# EAGLE design tiva-c (EAGLE 8.6.1)
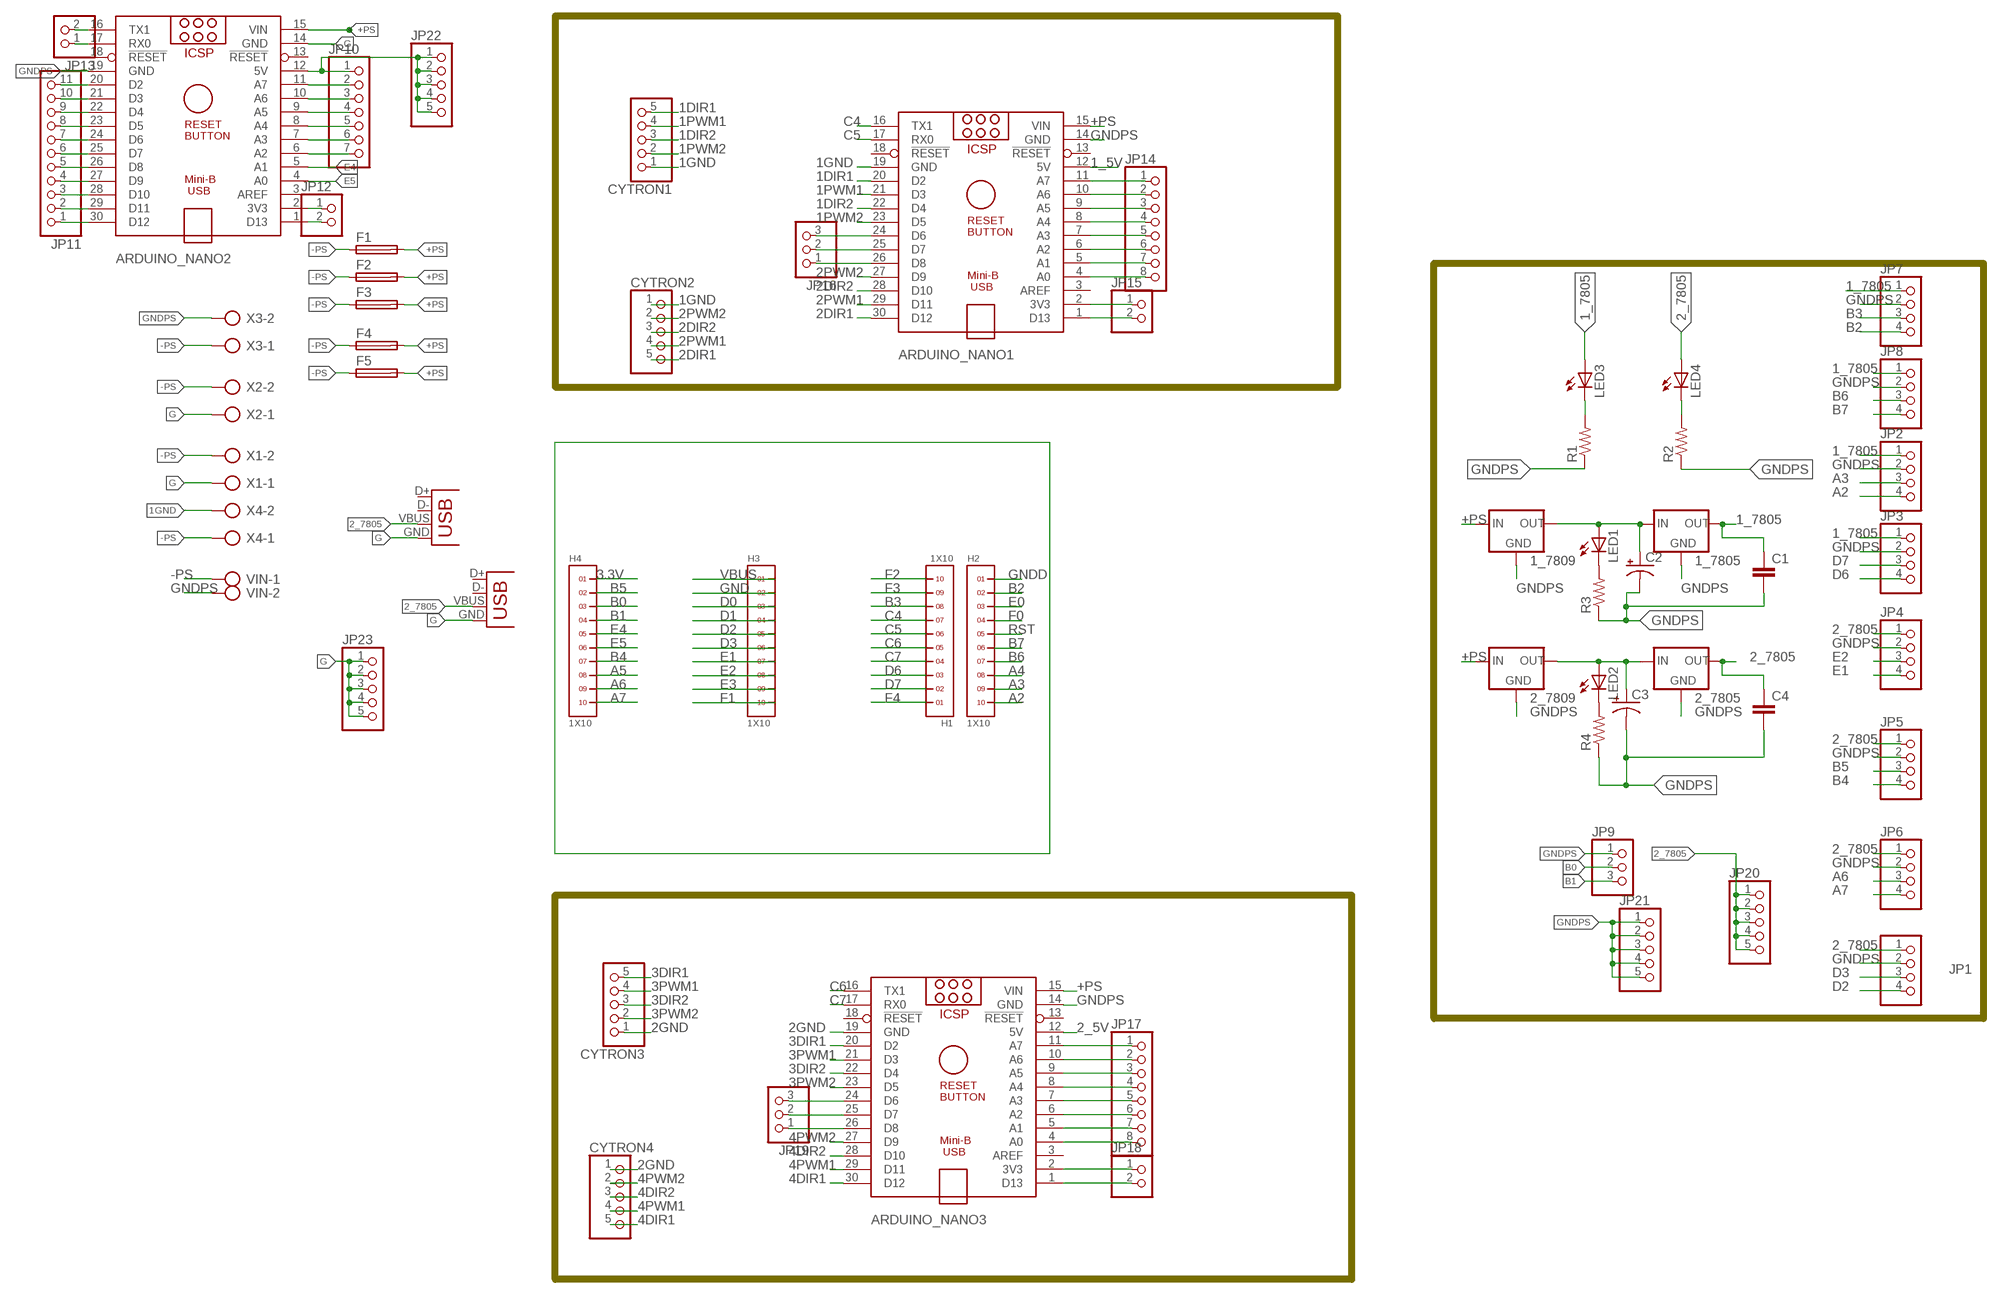
[diagram p0: schematic, sheet 1]

## Parts
1_7805  78XXS  [78XXS]
1_7809  78XXS  [78XXS]
2_7805  78XXS  [78XXS]
2_7809  78XXS  [78XXS]
ARDUINO_NANO1  ARDUINO_NANO  [ARDUINO_NANO]
ARDUINO_NANO2  ARDUINO_NANO  [ARDUINO_NANO]
ARDUINO_NANO3  ARDUINO_NANO  [ARDUINO_NANO]
C1  C-EU025-030X050  [C025-030X050]
C2  CPOL-USE2.5-5  [E2,5-5]
C3  CPOL-USE2.5-5  [E2,5-5]
C4  C-EU025-030X050  [C025-030X050]
CYTRON1  PINHD-1X5  [1X05]
CYTRON2  PINHD-1X5  [1X05]
CYTRON3  PINHD-1X5  [1X05]
CYTRON4  PINHD-1X5  [1X05]
F1  SH22,5A  [SH22,5A]
F2  SH22,5A  [SH22,5A]
F3  SH22,5A  [SH22,5A]
F4  SH22,5A  [SH22,5A]
F5  SH22,5A  [SH22,5A]
H1  1X10  [1X10]
H2  1X10  [1X10]
H3  1X10  [1X10]
H4  1X10  [1X10]
JP1  PINHD-1X4  [1X04]
JP2  PINHD-1X4  [1X04]
JP3  PINHD-1X4  [1X04]
JP4  PINHD-1X4  [1X04]
JP5  PINHD-1X4  [1X04]
JP6  PINHD-1X4  [1X04]
JP7  PINHD-1X4  [1X04]
JP8  PINHD-1X4  [1X04]
JP9  PINHD-1X3  [1X03]
JP10  PINHD-1X7  [1X07]
JP11  PINHD-1X11  [1X11]
JP12  PINHD-1X2  [1X02]
JP13  PINHD-1X2  [1X02]
JP14  PINHD-1X8  [1X08]
JP15  PINHD-1X2  [1X02]
JP16  PINHD-1X3  [1X03]
JP17  PINHD-1X8  [1X08]
JP18  PINHD-1X2  [1X02]
JP19  PINHD-1X3  [1X03]
JP20  PINHD-1X5  [1X05]
JP21  PINHD-1X5  [1X05]
JP22  PINHD-1X5  [1X05]
JP23  PINHD-1X5  [1X05]
LED1  LED5MM  [LED5MM]
LED2  LED5MM  [LED5MM]
LED3  LED5MM  [LED5MM]
LED4  LED5MM  [LED5MM]
R1  R-US_0204/5  [0204/5]
R2  R-US_0204/5  [0204/5]
R3  R-US_0204/5  [0204/5]
R4  R-US_0204/5  [0204/5]
VIN  AK300/2  [AK300/2]
X1  AK300/2  [AK300/2]
X2  AK300/2  [AK300/2]
X3  AK300/2  [AK300/2]
X4  AK300/2  [AK300/2]
X5  USB-A-H  [USB-A-H]
X6  USB-A-H  [USB-A-H]

## Nets
1_5V: ARDUINO_NANO1.12(5V)
1_7805: 1_7805.OUT C1.1 JP2.1 JP3.1 JP7.1 JP8.1 LED3.A
1DIR1: ARDUINO_NANO1.20(D2) CYTRON1.5
1DIR2: ARDUINO_NANO1.22(D4) CYTRON1.3
1GND: ARDUINO_NANO1.19(GND) CYTRON1.1 CYTRON2.1 X4.2
1PWM1: ARDUINO_NANO1.21(D3) CYTRON1.4
1PWM2: ARDUINO_NANO1.23(D5) CYTRON1.2
2_5V: ARDUINO_NANO3.12(5V)
2_7805: 2_7805.OUT C4.1 JP1.1 JP4.1 JP5.1 JP6.1 JP20.1 JP20.2 JP20.3 JP20.4 JP20.5 LED4.A X5.VBUS X6.VBUS
2DIR1: ARDUINO_NANO1.30(D12) CYTRON2.5
2DIR2: ARDUINO_NANO1.28(D10) CYTRON2.3
2GND: ARDUINO_NANO3.19(GND) CYTRON3.1 CYTRON4.1
2PWM1: ARDUINO_NANO1.29(D11) CYTRON2.4
2PWM2: ARDUINO_NANO1.27(D9) CYTRON2.2
3.3V: H4.1
3DIR1: ARDUINO_NANO3.20(D2) CYTRON3.5
3DIR2: ARDUINO_NANO3.22(D4) CYTRON3.3
3PWM1: ARDUINO_NANO3.21(D3) CYTRON3.4
3PWM2: ARDUINO_NANO3.23(D5) CYTRON3.2
4DIR1: ARDUINO_NANO3.30(D12) CYTRON4.5
4DIR2: ARDUINO_NANO3.28(D10) CYTRON4.3
4PWM1: ARDUINO_NANO3.29(D11) CYTRON4.4
4PWM2: ARDUINO_NANO3.27(D9) CYTRON4.2
+PS: 1_7809.IN 2_7809.IN ARDUINO_NANO1.15(VIN) ARDUINO_NANO2.15(VIN) ARDUINO_NANO3.15(VIN) F1.2 F2.2 F3.2 F4.2 F5.2
-PS: F1.1 F2.1 F3.1 F4.1 F5.1 VIN.1 X1.2 X2.2 X3.1 X4.1
A2: H2.10 JP2.4
A3: H2.9 JP2.3
A4: H2.8
A5: H4.8
A6: H4.9 JP6.3
A7: H4.10 JP6.4
B0: H4.3 JP9.2
B1: H4.4 JP9.3
B2: H2.2 JP7.4
B3: H1.8 JP7.3
B4: H4.7 JP5.4
B5: H4.2 JP5.3
B6: H2.7 JP8.3
B7: H2.6 JP8.4
C4: ARDUINO_NANO1.16(TX1) H1.7
C5: ARDUINO_NANO1.17(RX0) H1.6
C6: ARDUINO_NANO3.16(TX1) H1.5
C7: ARDUINO_NANO3.17(RX0) H1.4
D0: H3.3
D1: H3.4
D2: H3.5 JP1.4
D3: H3.6 JP1.3
D6: H1.3 JP3.4
D7: H1.2 JP3.3
E0: H2.3
E1: H3.7 JP4.4
E2: H3.8 JP4.3
E3: H3.9
E4: ARDUINO_NANO2.5(A1) H4.5
E5: ARDUINO_NANO2.4(A0) H4.6
F0: H2.4
F1: H3.10
F2: H1.10
F3: H1.9
F4: H1.1
G: ARDUINO_NANO2.14(GND) JP23.1 JP23.2 JP23.3 JP23.4 JP23.5 X1.1 X2.1 X5.GND X6.GND
GND: H3.2
GNDD: H2.1
GNDPS: 1_7805.GND 1_7809.GND 2_7805.GND 2_7809.GND ARDUINO_NANO1.14(GND) ARDUINO_NANO2.19(GND) ARDUINO_NANO3.14(GND) C1.2 C2.- C3.- C4.2 JP1.2 JP2.2 JP3.2 JP4.2 JP5.2 JP6.2 JP7.2 JP8.2 JP9.1 JP21.1 JP21.2 JP21.3 JP21.4 JP21.5 R1.1 R2.1 R3.1 R4.1 VIN.2 X3.2
N$2: 2_7805.IN 2_7809.OUT C3.+ LED2.A
N$3: 1_7805.IN 1_7809.OUT C2.+ LED1.A
N$4: LED3.K(C) R1.2
N$5: LED4.K(C) R2.2
N$6: LED1.K(C) R3.2
N$7: LED2.K(C) R4.2
N$8: ARDUINO_NANO2.2(3V3) JP12.1
N$9: ARDUINO_NANO2.11(A7) JP10.2
N$10: ARDUINO_NANO2.10(A6) JP10.3
N$11: ARDUINO_NANO2.9(A5) JP10.4
N$12: ARDUINO_NANO2.8(A4) JP10.5
N$13: ARDUINO_NANO2.7(A3) JP10.6
N$14: ARDUINO_NANO2.6(A2) JP10.7
N$15: ARDUINO_NANO2.30(D12) JP11.1
N$16: ARDUINO_NANO2.29(D11) JP11.2
N$17: ARDUINO_NANO2.28(D10) JP11.3
N$18: ARDUINO_NANO2.27(D9) JP11.4
N$19: ARDUINO_NANO2.26(D8) JP11.5
N$20: ARDUINO_NANO2.25(D7) JP11.6
N$21: ARDUINO_NANO2.24(D6) JP11.7
N$22: ARDUINO_NANO2.23(D5) JP11.8
N$23: ARDUINO_NANO2.22(D4) JP11.9
N$24: ARDUINO_NANO2.21(D3) JP11.10
N$25: ARDUINO_NANO2.20(D2) JP11.11
N$26: ARDUINO_NANO2.1(D13) JP12.2
N$29: ARDUINO_NANO2.17(RX0) JP13.1
N$30: ARDUINO_NANO2.16(TX1) JP13.2
N$31: ARDUINO_NANO1.11(A7) JP14.1
N$32: ARDUINO_NANO1.10(A6) JP14.2
N$33: ARDUINO_NANO1.9(A5) JP14.3
N$34: ARDUINO_NANO1.8(A4) JP14.4
N$35: ARDUINO_NANO1.7(A3) JP14.5
N$36: ARDUINO_NANO1.6(A2) JP14.6
N$37: ARDUINO_NANO1.5(A1) JP14.7
N$38: ARDUINO_NANO1.4(A0) JP14.8
N$39: ARDUINO_NANO1.2(3V3) JP15.1
N$40: ARDUINO_NANO1.1(D13) JP15.2
N$41: ARDUINO_NANO1.26(D8) JP16.1
N$42: ARDUINO_NANO1.25(D7) JP16.2
N$43: ARDUINO_NANO1.24(D6) JP16.3
N$44: ARDUINO_NANO3.11(A7) JP17.1
N$45: ARDUINO_NANO3.10(A6) JP17.2
N$46: ARDUINO_NANO3.9(A5) JP17.3
N$47: ARDUINO_NANO3.8(A4) JP17.4
N$48: ARDUINO_NANO3.7(A3) JP17.5
N$49: ARDUINO_NANO3.6(A2) JP17.6
N$50: ARDUINO_NANO3.5(A1) JP17.7
N$51: ARDUINO_NANO3.4(A0) JP17.8
N$52: ARDUINO_NANO3.2(3V3) JP18.1
N$53: ARDUINO_NANO3.1(D13) JP18.2
N$54: ARDUINO_NANO3.26(D8) JP19.1
N$55: ARDUINO_NANO3.25(D7) JP19.2
N$56: ARDUINO_NANO3.24(D6) JP19.3
N$59: ARDUINO_NANO2.12(5V) JP10.1 JP22.1 JP22.2 JP22.3 JP22.4 JP22.5
RST: H2.5
VBUS: H3.1
Unconnected: ARDUINO_NANO1.3(AREF) ARDUINO_NANO1.13(!RESET) ARDUINO_NANO1.18(!RESET) ARDUINO_NANO2.3(AREF) ARDUINO_NANO2.13(!RESET) ARDUINO_NANO2.18(!RESET) ARDUINO_NANO3.3(AREF) ARDUINO_NANO3.13(!RESET) ARDUINO_NANO3.18(!RESET) X5.D+ X5.D- X6.D+ X6.D-

## Library data of the parts
1_7805 1_7809 2_7805 2_7809 = v-reg:78XXS: VOLTAGE REGULATOR
ARDUINO_NANO1-ARDUINO_NANO3 = ArduinoNanoV30:ARDUINO_NANO: Arduino Nano V3.0 Overview: The Arduino Nano is a small, complete, and breadboard-friendly board based on the ATmega328 (Arduino Nano 3.x) or ATmega168 (Arduino Nano 2.x). It has more or less the same functionality of the Arduino Duemilanove, but in a different package. It lacks only a DC power jack, and works with a Mini-B USB cable instead of a standard one. The Nano was designed and is being produced by Gravitech. Specifications: Microcontroller Atmel ATmega168 or ATmega328 Operating Voltage (logic level) 5 V Input Voltage (recommended) 7-12 V Input Voltage (limits) 6-20 V Digital I/O Pins 14 (of which 6 provide PWM output) Analog Input Pins 8 DC Current per I/O Pin 40 mA Flash Memory 16 KB (ATmega168) or 32 KB (ATmega328) of which 2 KB used by bootloader SRAM 1 KB (ATmega168) or 2 KB (ATmega328) EEPROM 512 bytes (ATmega168) or 1 KB (ATmega328) Clock Speed 16 MHz Dimensions 0.73" x 1.70" Length 45 mm Width 18 mm Weigth 5 g Power: The Arduino Nano can be powered via the Mini-B USB connection, 6-20V unregulated external power supply (pin 30), or 5V regulated external power supply (pin 27). The power source is automatically selected to the highest voltage source. Memory: The ATmega168 has 16 KB of flash memory for storing code (of which 2 KB is used for the bootloader); the ATmega328 has 32 KB, (also with 2 KB used for the bootloader). The ATmega168 has 1 KB of SRAM and 512 bytes of EEPROM (which can be read and written with the EEPROM library); the ATmega328 has 2 KB of SRAM and 1 KB of EEPROM. Input and Output: Each of the 14 digital pins on the Nano can be used as an input or output, using pinMode(), digitalWrite(), and digitalRead() functions. They operate at 5 volts. Each pin can provide or receive a maximum of 40 mA and has an internal pull-up resistor (disconnected by default) of 20-50 kOhms. In addition, some pins have specialized functions. Visit Arduino - ArduinoBoardNano <https://www.arduino.cc/en/Main/ArduinoBoardNano>
C1 C4 = rcl:C-EU: CAPACITOR, European symbol; SPICEPREFIX: C
C2 C3 = rcl:CPOL-US: POLARIZED CAPACITOR, American symbol; SPICEPREFIX: C
CYTRON1-CYTRON4 JP20-JP23 = pinhead:PINHD-1X5: PIN HEADER
F1-F5 = fuse:SH22,5A: FUSE HOLDER grid 22,5mm, isolated cap OGN0031 8201, Schurter (Buerklin); MPN: 0031.7701.11; OC_FARNELL: unknown; OC_NEWARK: 04F1224
H1-H4 = headers(.1in):1X10
JP1-JP8 = pinhead:PINHD-1X4: PIN HEADER
JP9 JP16 JP19 = pinhead:PINHD-1X3: PIN HEADER
JP10 = pinhead:PINHD-1X7: PIN HEADER
JP11 = pinhead:PINHD-1X11: PIN HEADER
JP12 JP13 JP15 JP18 = pinhead:PINHD-1X2: PIN HEADER
JP14 JP17 = pinhead:PINHD-1X8: PIN HEADER
LED1-LED4 = led:LED: LED OSRAM: - CHIPLED LG R971, LG N971, LY N971, LG Q971, LY Q971, LO R971, LY R971 LH N974, LH R974 LS Q976, LO Q976, LY Q976 LO Q996 - Hyper CHIPLED LW Q18S LB Q993, LB Q99A, LB R99A - SideLED LS A670, LO A670, LY A670, LG A670, LP A670 LB A673, LV A673, LT A673, LW A673 LH A674 LY A675 LS A676, LA A676, LO A676, LY A676, LW A676 LS A679, LY A679, LG A679 - Hyper Micro SIDELED® LS Y876, LA Y876, LO Y876, LY Y876 LT Y87S - SmartLED LW L88C, LW L88S LB L89C, LB L89S, LG L890 LS L89K, LO L89K, LY L89K LS L896, LA L896, LO L896, LY L896 - TOPLED LS T670, LO T670, LY T670, LG T670, LP T670 LSG T670, LSP T670, LSY T670, LOP T670, LYG T670 LG T671, LOG T671, LSG T671 LB T673, LV T673, LT T673, LW T673 LH T674 LS T676, LA T676, LO T676, LY T676, LB T676, LH T676, LSB T676, LW T676 LB T67C, LV T67C, LT T67C, LS T67K, LO T67K, LY T67K, LW E67C LS E67B, LA E67B, LO E67B, LY E67B, LB E67C, LV E67C, LT E67C LW T67C LS T679, LY T679, LG T679 LS T770, LO T770, LY T770, LG T770, LP T770 LB T773, LV T773, LT T773, LW T773 LH T774 LS E675, LA E675, LY E675, LS T675 LS T776, LA T776, LO T776, LY T776, LB T776 LHGB T686 LT T68C, LB T68C - Hyper Mini TOPLED® LB M676 - Mini TOPLED Santana® LG M470 LS M47K, LO M47K, LY M47K Source: http://www.osram.convergy.de LUXEON: - LUMILED® LXK2-PW12-R00, LXK2-PW12-S00, LXK2-PW14-U00, LXK2-PW14-V00 LXK2-PM12-R00, LXK2-PM12-S00, LXK2-PM14-U00 LXK2-PE12-Q00, LXK2-PE12-R00, LXK2-PE12-S00, LXK2-PE14-T00, LXK2-PE14-U00 LXK2-PB12-K00, LXK2-PB12-L00, LXK2-PB12-M00, LXK2-PB14-N00, LXK2-PB14-P00, LXK2-PB14-Q00 LXK2-PR12-L00, LXK2-PR12-M00, LXK2-PR14-Q00, LXK2-PR14-R00 LXK2-PD12-Q00, LXK2-PD12-R00, LXK2-PD12-S00 LXK2-PH12-R00, LXK2-PH12-S00 LXK2-PL12-P00, LXK2-PL12-Q00, LXK2-PL12-R00 Source: www.luxeon.com KINGBRIGHT: KA-3528ASYC Source: www.kingbright.com
R1-R4 = rcl:R-US_: RESISTOR, American symbol; SPICEPREFIX: R
VIN X1-X4 = con-ptr500:AK300/2: CONNECTOR; OC_FARNELL: unknown; OC_NEWARK: unknown
X5 X6 = con-usb:USB: USB Connectors

## Board
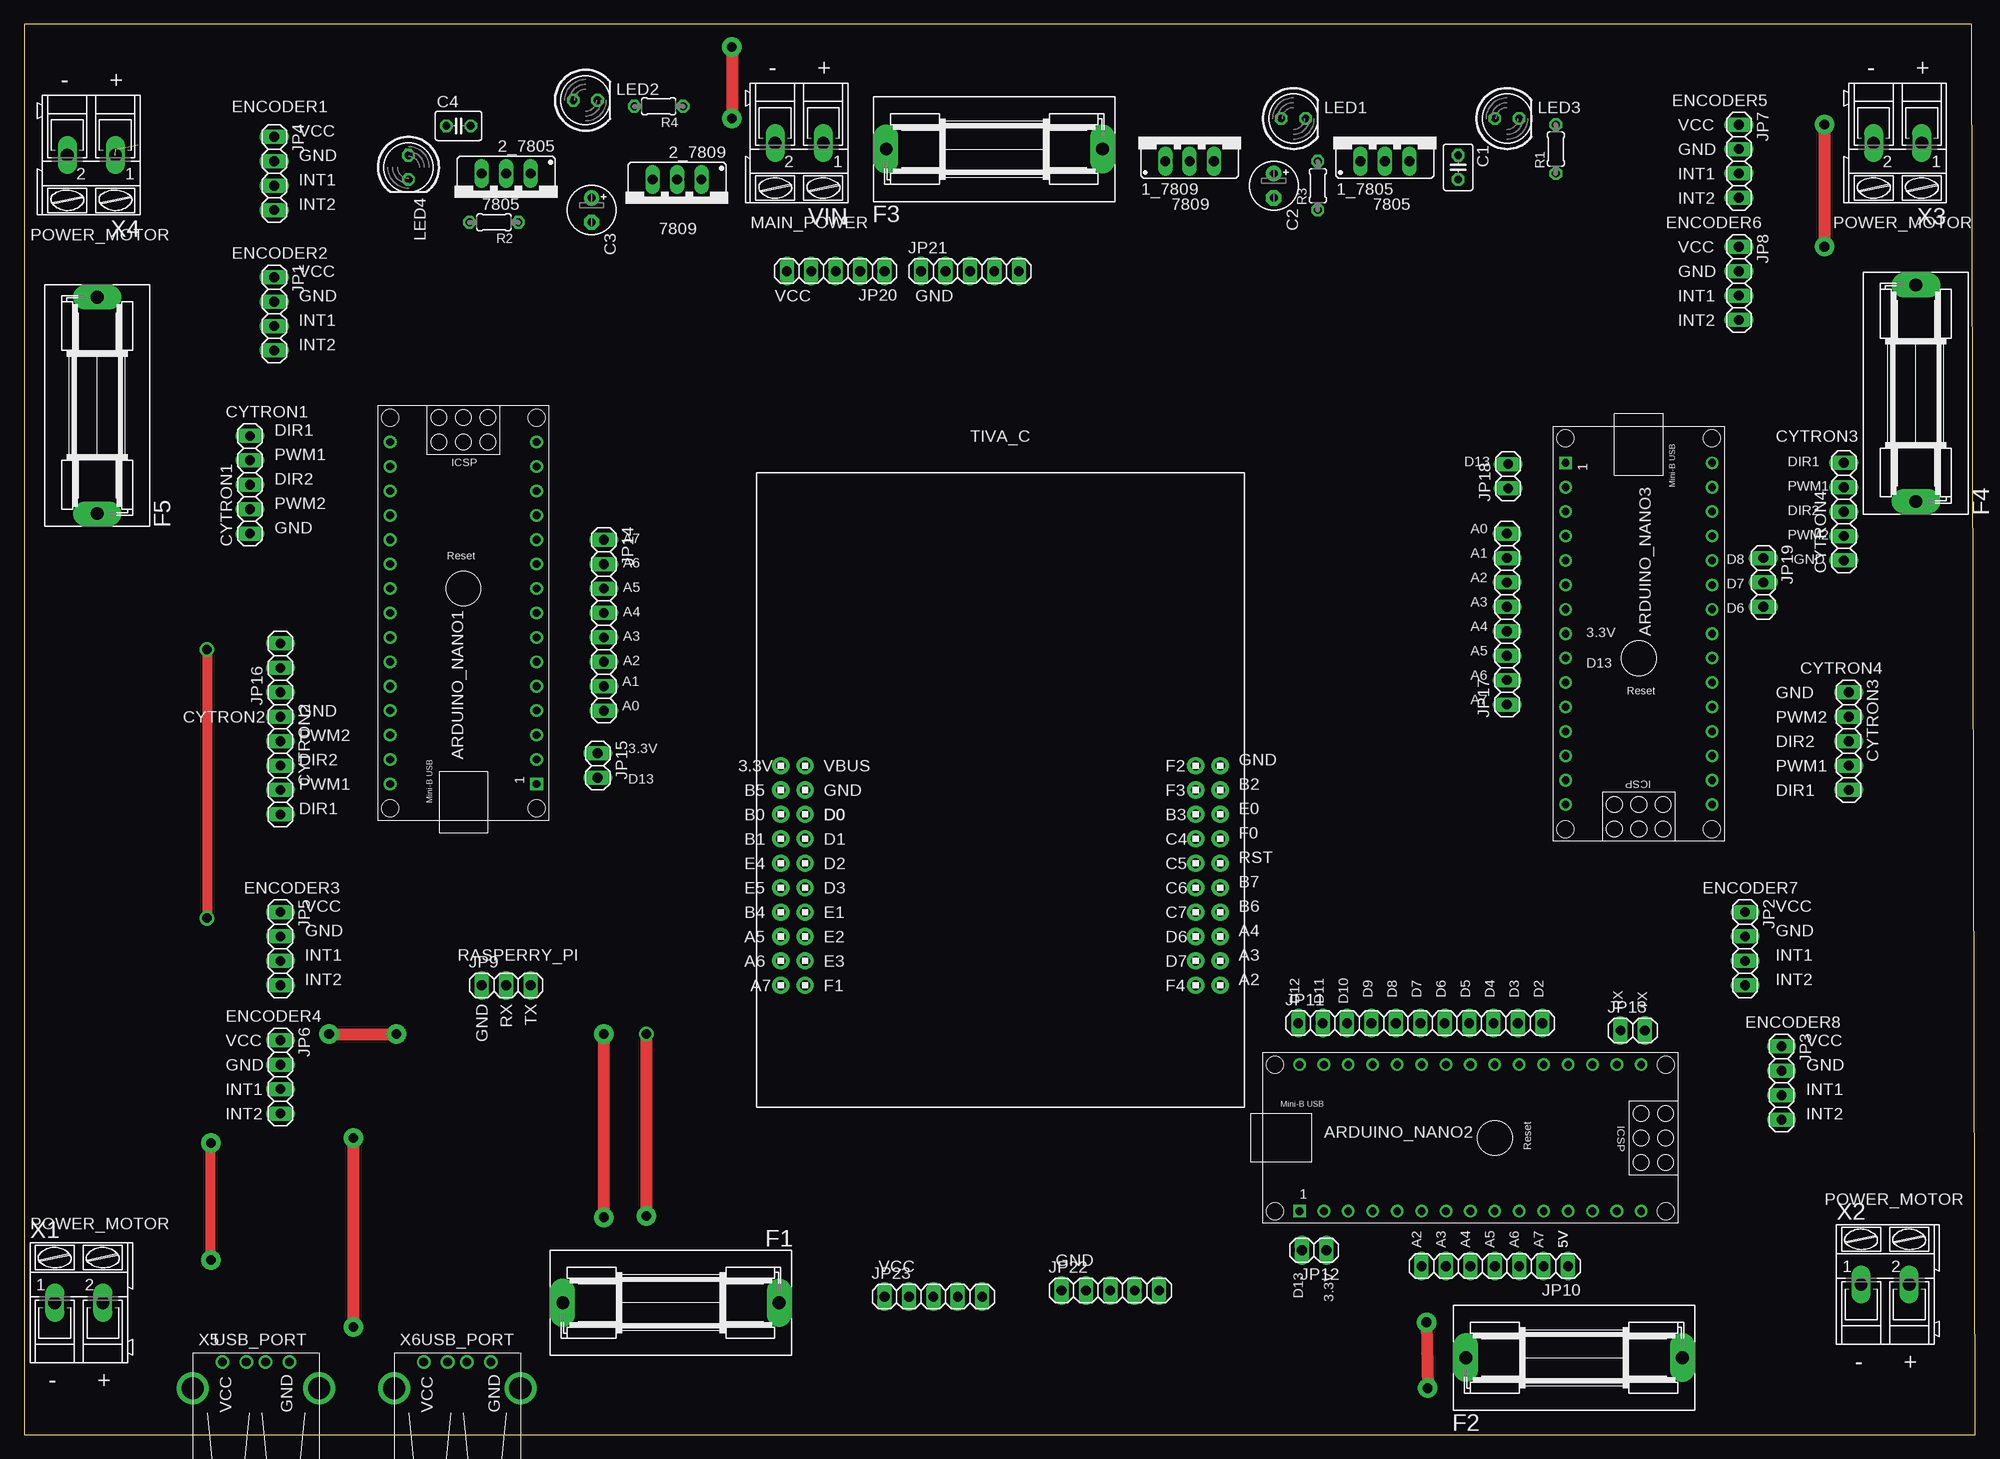
[diagram p1: board, top side]
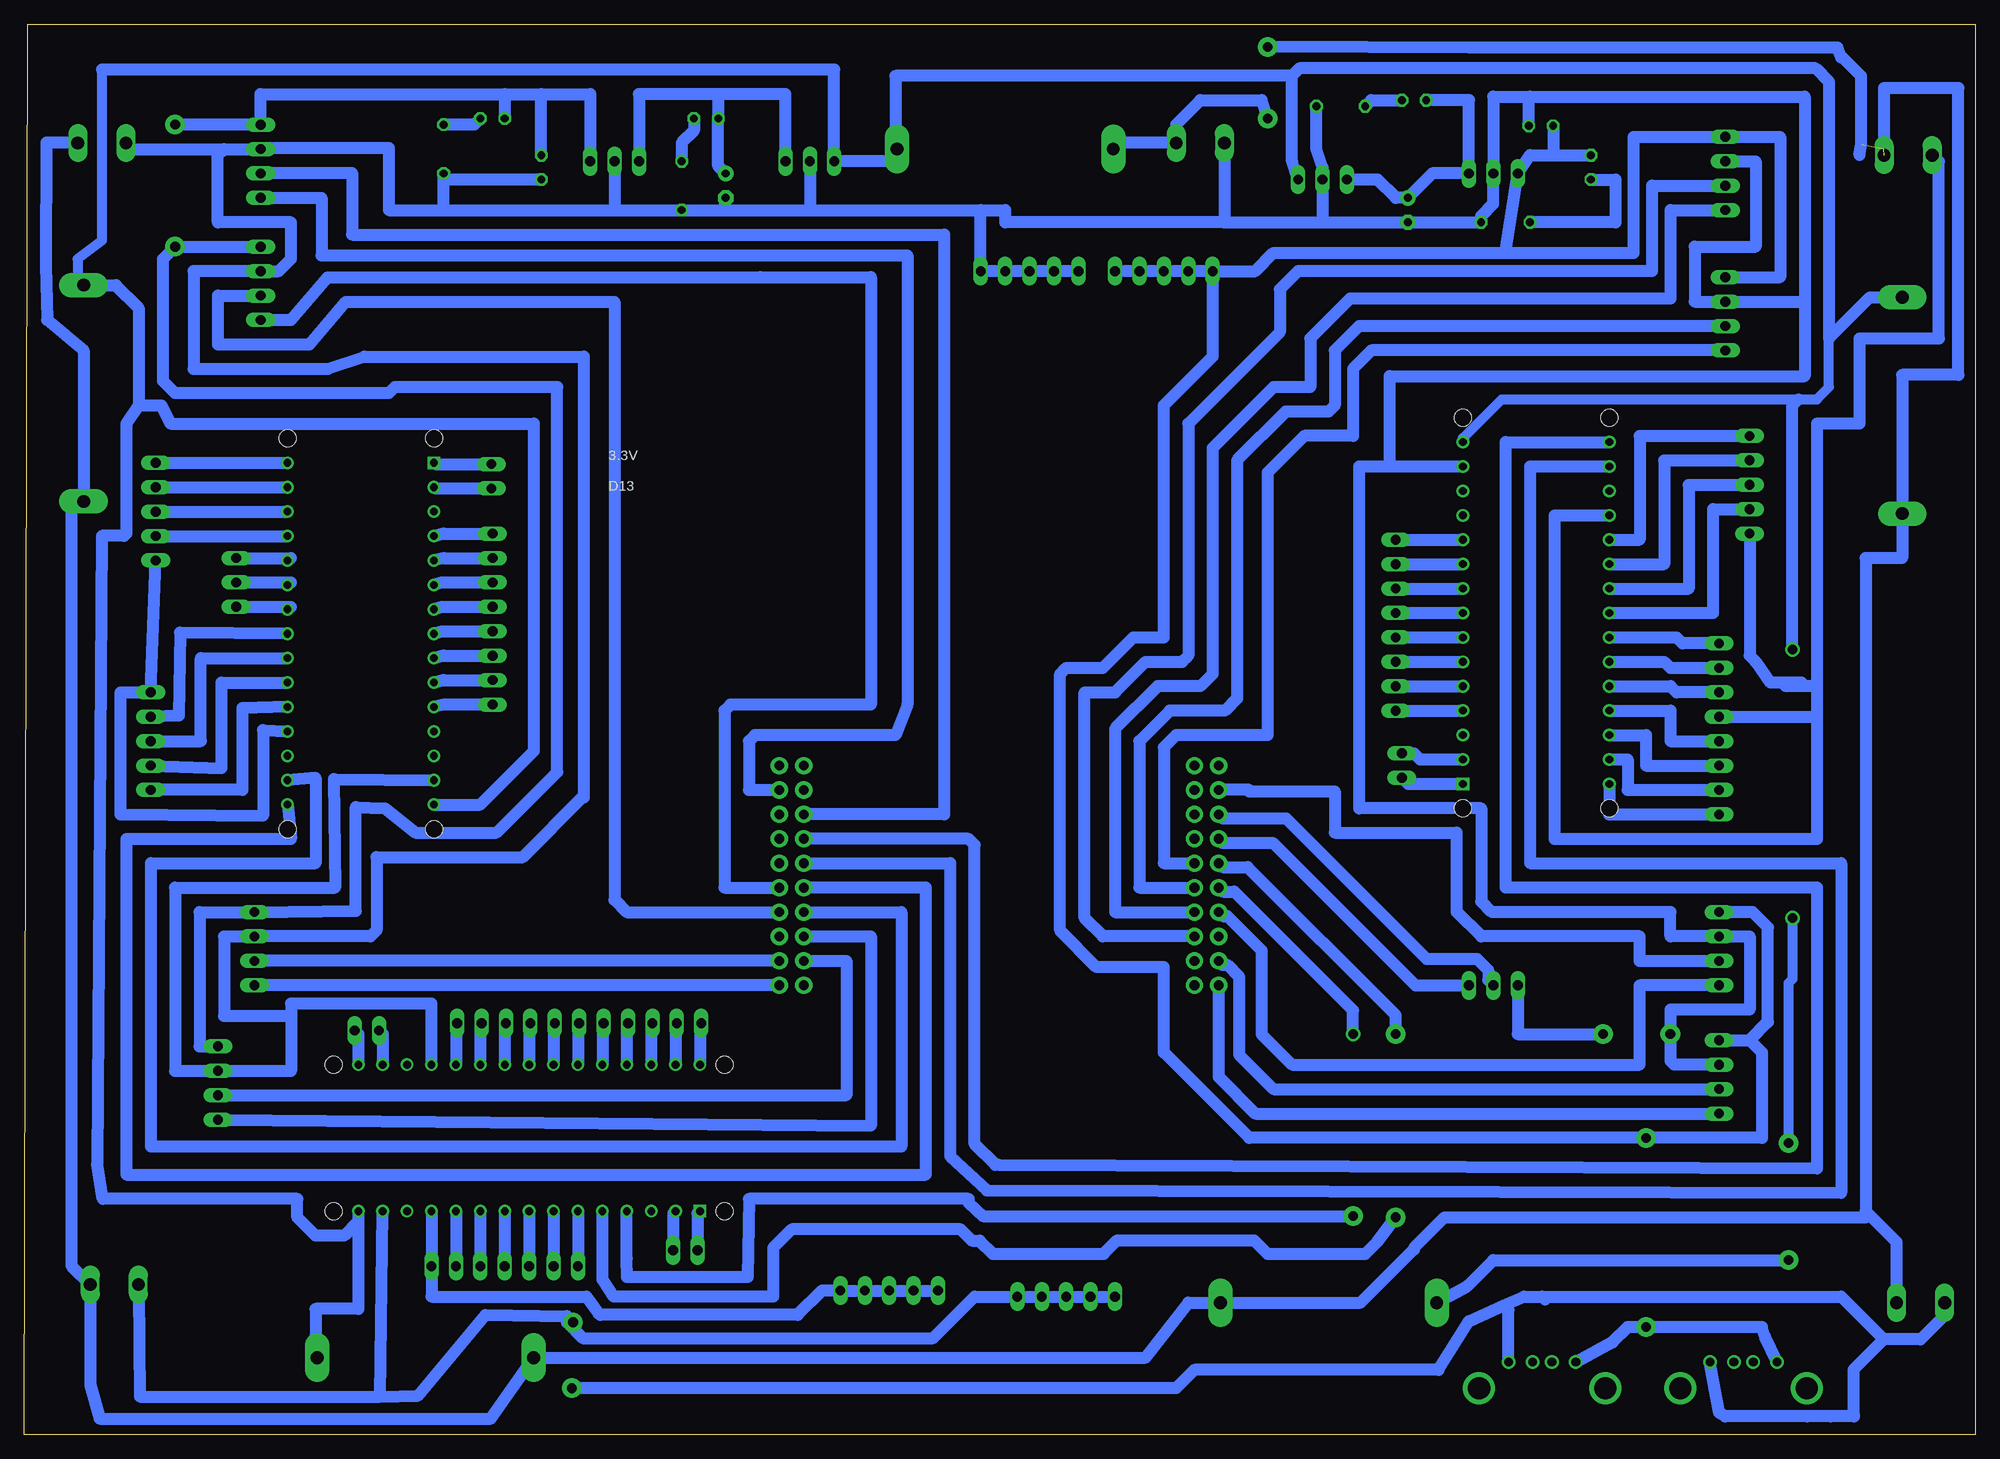
[diagram p2: board, bottom side, seen from below]

Size 203.05 x 146.74 mm. Coordinates in mm from the lower left corner, seen from the top.
Outline: 0,0 203.05,0 202.67,146.74 0,146.74 0,0
Copper layers (1*16): Top 0.035mm / dielectric 1.5mm / Bottom 0.035mm
Design rules "default *": minimum track width 50mil, minimum drill 0.8mm, track to track 0.6mm, track to pad 0.6mm, pad to pad 25mil, via to via 50mil, smd to smd 6mil, copper to edge 40mil, drill to drill 6mil, minimum pad ring 10mil, minimum via ring 8mil, stop-mask expansion 4mil, vias tented up to drill 0mil, thermal gap 10mil

### Footprints (pad centres in the part's own frame; a part is rotated, then mirrored left to right if it is on the bottom)
78XXS = drill 1.016 long: GND 0,-2.54; IN -2.54,-2.54; OUT 2.54,-2.54
ARDUINO_NANO = drill 0.8 square: 1 -20.32,-7.62 | drill 0.8: 2 -17.78,-7.62; 3 -15.24,-7.62; 4 -12.7,-7.62; 5 -10.16,-7.62; 6 -7.62,-7.62; 7 -5.08,-7.62; 8 -2.54,-7.62; 9 0,-7.62; 10 2.54,-7.62; 11 5.08,-7.62; 12 7.62,-7.62; 13 10.16,-7.62; 14 12.7,-7.62; 15 15.24,-7.62; 16 15.24,7.62; 17 12.7,7.62; 18 10.16,7.62; 19 7.62,7.62; 20 5.08,7.62; 21 2.54,7.62; 22 0,7.62; 23 -2.54,7.62; 24 -5.08,7.62; 25 -7.62,7.62; 26 -10.16,7.62; 27 -12.7,7.62; 28 -15.24,7.62; 29 -17.78,7.62; 30 -20.32,7.62 | hole 1.778: -22.86,-7.62; -22.86,7.62; 17.78,7.62; 17.78,-7.62
C025-030X050 = drill 0.813 octagon: 1 -1.27,0; 2 1.27,0
E2,5-5 = drill 0.813 pad 1.6: + -1.27,0 | drill 0.813 pad 1.6 octagon: - 1.27,0
1X05 = drill 1.016 long: 1 -5.08,0; 2 -2.54,0; 3 0,0; 4 2.54,0; 5 5.08,0
SH22,5A = drill 1.321 pad 2.54 long: 1 -11.252,0; 2 11.252,0
1X10 = drill 1.016 pad 1.778: 1 0,0; 2 2.54,0; 3 5.08,0; 4 7.62,0; 5 10.16,0; 6 12.7,0; 7 15.24,0; 8 17.78,0; 9 20.32,0; 10 22.86,0
1X04 = drill 1.016 long: 1 -3.81,0; 2 -1.27,0; 3 1.27,0; 4 3.81,0
1X03 = drill 1.016 long: 1 -2.54,0; 2 0,0; 3 2.54,0
1X07 = drill 1.016 long: 1 -7.62,0; 2 -5.08,0; 3 -2.54,0; 4 0,0; 5 2.54,0; 6 5.08,0; 7 7.62,0
1X11 = drill 1.016 long: 1 -12.7,0; 2 -10.16,0; 3 -7.62,0; 4 -5.08,0; 5 -2.54,0; 6 0,0; 7 2.54,0; 8 5.08,0; 9 7.62,0; 10 10.16,0; 11 12.7,0
1X02 = drill 1.016 long: 1 -1.27,0; 2 1.27,0
1X08 = drill 1.016 long: 1 -8.89,0; 2 -6.35,0; 3 -3.81,0; 4 -1.27,0; 5 1.27,0; 6 3.81,0; 7 6.35,0; 8 8.89,0
LED5MM = drill 0.813 octagon: A -1.27,0; K 1.27,0
0204/5 = drill 0.813 octagon: 1 -2.54,0; 2 2.54,0
AK300/2 = drill 1.321 long: 1 -2.515,0; 2 2.489,0
USB-A-H = drill 0.914: D+ 2.718,-1.003; D- 2.718,1.003; GND 2.718,-3.493; VBUS 2.718,3.493 | drill 2.311: P$5 0,-6.566; P$6 0,6.566

### Placement (x,y rotation side)
1_7805  141.6,135 0 top
1_7809  121.28,135 0 top
2_7805  50.16,128.65 180 top
2_7809  67.94,128.02 180 top
ARDUINO_NANO1  45.72,88.01 90 top
ARDUINO_NANO2  153.03,30.86 0 top
ARDUINO_NANO3  168.02,80.77 270 top
C1  149.22,131.83 270 top
C2  130.05,129.92 270 top
C3  59.06,127.38 270 top
C4  45.21,136.14 0 top
CYTRON1  23.5,98.81 90 top
CYTRON2  26.67,69.6 270 top
CYTRON3  189.87,72.14 270 top
CYTRON4  189.36,96.01 90 top
F1  67.31,13.72 180 top
F2  161.29,8 0 top
F3  100.97,133.73 0 top
F4  196.85,108.33 90 top
F5  7.62,107.06 90 top
H1  121.92,46.74 90 top
H2  124.46,69.6 270 top
H3  81.28,69.6 270 top
H4  78.74,69.6 270 top
JP1  26.04,116.59 270 top
JP2  179.07,50.55 270 top
JP3  182.88,36.58 270 top
JP4  26.04,131.19 270 top
JP5  26.67,50.55 270 top
JP6  26.67,37.21 270 top
JP7  178.44,132.46 270 top
JP8  178.44,119.76 270 top
JP9  50.16,46.74 0 top
JP10  153.03,17.53 180 top
JP11  145.29,42.8 0 top
JP12  134.24,19.18 180 top
JP13  167.39,42.04 0 top
JP14  60.33,84.2 270 top
JP15  59.69,69.6 270 top
JP16  26.67,79.76 90 top
JP17  154.31,84.84 90 top
JP18  154.43,99.7 90 top
JP19  180.97,88.65 270 top
JP20  84.45,121.03 180 top
JP21  98.42,121.03 0 top
JP22  113.03,14.99 0 top
JP23  94.61,14.35 0 top
LED1  132.08,136.91 0 top
LED2  58.42,138.81 0 top
LED3  154.31,136.91 0 top
LED4  40.01,131.83 270 top
R1  159.38,133.73 90 top
R2  48.89,126.11 180 top
R3  134.62,129.92 90 top
R4  66.04,138.18 180 top
VIN  80.64,134.37 180 top
X1  5.71,13.72 0 top
X2  193.67,15.62 0 top
X3  194.94,134.37 180 top
X4  6.98,133.1 180 top
X5  24.13,4.83 90 top
X6  45.09,4.83 90 top

### Tracks (layer width: path | path; a pad name or v marks a point on that pad's centre or on a via)
1_7805  (via drill 1 pad 2.03)
  Top 1.27: v187.32,136.27 v187.32,123.57
  Bottom 1.27: 153.03,139.45 178.44,139.45 JP7.1 v187.32,136.27 | 153.03,139.45 149.22,139.45 | 149.22,139.45 144.15,139.45 1_7805.OUT | JP3.1 184.78,40.39 184.78,54.36 JP2.1 168.53,54.48 168.53,65.28 165.52,65.15 162.34,62.61 153.89,62.61 147.57,68.93 147.57,108.97 164.47,108.97 165.1,108.33 187.32,108.33 188.59,109.6 188.59,122.3 v187.32,123.57 JP8.1 | 153.03,139.45 LED3.A | C1.1 149.22,139.45
1DIR1
  Bottom 1.27: CYTRON1.5 34.92,103.89 34.92,93.09 ARDUINO_NANO1.20
1DIR2
  Bottom 1.27: CYTRON1.3 29.84,98.81 29.84,88.01 ARDUINO_NANO1.22
1GND
  Bottom 1.27: 16.51,74.68 16.51,61.98 43.81,61.98 43.81,95.63 ARDUINO_NANO1.19 | CYTRON2.1 16.51,74.68 | 16.51,77.85 16.51,105.16 12.06,105.16 12.06,114.05 3.81,114.05 3.81,132.41 X4.2 | 16.51,77.85 16.51,74.68 | 16.51,77.85 19.75,77.85 18.09,78.23 21.34,78.23 22.86,80.39 23.5,81.03 CYTRON1.1
1PWM1
  Bottom 1.27: CYTRON1.4 32.38,101.35 32.38,90.55 ARDUINO_NANO1.21
1PWM2
  Bottom 1.27: CYTRON1.2 27.3,96.27 27.3,85.47 ARDUINO_NANO1.23
2_7805  (via drill 1 pad 2.03)
  Top 1.27: v34.29,11.18 v34.29,30.86
  Bottom 1.27: JP1.1 20.32,120.4 20.32,135 JP4.1 35.56,135 35.56,122.94 48.89,122.94 | 43.81,133.1 46.36,133.1 2_7805.OUT 48.89,122.94 | 43.81,133.1 LED4.A | JP6.1 23.5,41.02 | 23.5,41.02 22.23,39.75 22.23,30.86 v34.29,30.86 75.56,30.86 84.45,39.75 84.45,48.64 91.44,48.64 95.25,52.45 95.25,79.12 94.61,79.76 90.8,79.76 87.63,82.93 84.45,82.93 84.45,107.06 79.38,112.14 JP20.5 | 48.89,122.94 73.03,122.94 74.93,121.03 JP20.5 | JP5.1 23.18,54.36 21.59,52.77 21.59,42.93 23.5,41.02 | JP20.5 JP20.4 JP20.3 JP20.2 JP20.1 | C4.1 43.94,133.22 43.81,133.1 | X5.VBUS 21.91,10.22 22.23,11.18 v34.29,11.18 36.2,11.18 37.78,9.59 X6.VBUS
2DIR1
  Bottom 1.27: CYTRON2.5 38.1,64.52 ARDUINO_NANO1.30
2DIR2
  Bottom 1.27: ARDUINO_NANO1.28 34.29,72.77 34.29,69.6 CYTRON2.3
2GND
  Bottom 1.27: CYTRON4.1 CYTRON3.1 193.04,77.22 193.04,64.52 178.18,64.39 178.18,73.28 ARDUINO_NANO3.19
2PWM1
  Bottom 1.27: CYTRON2.4 36.2,67.06 36.2,70.23 ARDUINO_NANO1.29
2PWM2
  Bottom 1.27: CYTRON2.2 31.75,72.14 31.75,75.31 ARDUINO_NANO1.27
3DIR1
  Bottom 1.27: ARDUINO_NANO3.20 180.34,75.56 180.34,67.06 CYTRON3.5
3DIR2
  Bottom 1.27: CYTRON3.3 184.66,72.14 184.66,80.77 ARDUINO_NANO3.22
3PWM1
  Bottom 1.27: ARDUINO_NANO3.21 182.5,78.23 182.5,69.34 CYTRON3.4
3PWM2
  Bottom 1.27: ARDUINO_NANO3.23 186.82,83.44 186.94,74.8 CYTRON3.2
4DIR1
  Bottom 1.27: CYTRON4.5 ARDUINO_NANO3.30
4DIR2
  Bottom 1.27: CYTRON4.3 ARDUINO_NANO3.28
4PWM1
  Bottom 1.27: CYTRON4.4 ARDUINO_NANO3.29
4PWM2
  Bottom 1.27: CYTRON4.2 ARDUINO_NANO3.27
+PS  (via drill 1 pad 1.52, 1 pad 2.03)
  Top 1.016: v19.43,18.16 v19.43,30.35 | v19.05,81.66 v19.05,53.72
  Bottom 1.016: 194.94,141.99 194.94,124.21 197.48,122.3 197.48,119.76 | v19.43,30.35 19.43,46.99 19.05,47.37 v19.05,53.72 | ARDUINO_NANO1.15 53.34,103.65 49.29,107.7 18.41,107.7 16.51,107.7 15.24,108.97 15.24,114.05
  Bottom 1.27: F3.2 112.22,132.46 | 112.22,132.46 1_7809.IN 118.74,141.99 194.94,141.99 | F2.2 172.72,9.45 172.72,13.08 168.28,13.08 ARDUINO_NANO2.15 168.28,22.19 169.76,20.7 172.72,20.7 174.62,22.61 174.62,24.51 194.84,24.51 195.45,28.17 194.94,93.49 192.64,93.49 192.41,93.73 192.41,105.16 191.13,107.06 | 191.13,107.06 191.13,117.22 193.5,119.58 F4.2 197.48,119.76 | 191.13,107.06 188.75,107.06 187.8,105.16 149.99,105.16 149.99,71.12 155.58,65.53 ARDUINO_NANO3.15 | F1.2 52.88,15.44 50.16,18.16 v19.43,18.16 | 2_7809.IN 71.12,132.46 71.12,141.35 | 71.12,141.35 112.39,141.35 112.39,132.64 112.22,132.46 | 71.12,141.35 70.36,142.11 16.64,142.11 15.24,140.72 15.24,114.05 10.97,118.31 F5.2 | v19.05,81.66 19.05,107.06 18.41,107.7
-PS  (via drill 1 pad 2.03)  (2 unrouted)
  Top 1.27: v73.66,144.36 73.66,136.78 v73.66,136.91
  Bottom 1.27: 9.52,133.73 9.52,140.08 1.78,140.08 1.78,110.24 7.62,110.24 F5.1 7.62,91.19 11.43,91.19 11.43,23.24 | 11.43,23.24 11.43,22.61 55.25,22.61 58.42,19.43 58.42,19.28 63.98,13.72 F1.1 81.92,13.72 86.36,8 F2.1 154.48,1.65 195.2,1.65 196.16,5.16 X2.2 198.12,17.58 198.12,96.9 197.94,97.08 F4.1 196.85,112.78 200.66,115.95 200.79,121.67 200.74,134.42 200.69,134.37 X3.1 | F3.1 89.53,133.73 89.53,134.37 VIN.1 83.16,136.3 80.64,138.81 74.3,138.81 v73.66,136.91 | X1.2 8.2,20.02 11.43,23.24 | 12.06,133.1 11.89,134.19 11.89,141.33 13.97,143.41 13.97,143.26 14.37,144.29 52.07,144.29 52.71,144.29 v73.66,144.36
A2
  Bottom 1.27: H2.10 JP2.4
A3
  Bottom 1.27: H2.9 JP2.3
A6
  Bottom 1.27: H4.9 78.32,48.86 77.86,48.86 76.62,47.62 76.62,39.53 73.03,35.94 JP6.3
A7
  Bottom 1.27: JP6.4 74.93,33.4 78.74,37.21 H4.10
B0
  Bottom 1.27: H4.3 78.32,64.1 71.73,64.1 57.12,49.5 51.88,49.5 50.71,48.33 50.71,47.28 JP9.2
B1
  Bottom 1.27: JP9.3 58.28,46.74 73.1,61.56 78.32,61.56 H4.4
B2
  Bottom 1.27: JP7.4 172.09,128.65 172.09,122.68 111.12,122.68 111.12,75.95 112.39,72.77 127,72.77 127.63,72.14 127.63,67.06 H2.2
B3
  Bottom 1.27: JP7.3 178.38,131.24 168.91,131.24 168.91,124.84 107.31,124.84 107.31,64.52 H1.8
B4
  Bottom 1.27: JP5.4 34.92,46.74 34.92,38.48 71.12,38.48 74.3,41.66 74.3,50.38 77.86,53.94 78.32,53.94 H4.7
B5
  Bottom 1.27: JP5.3 34.92,49.28 34.92,51.82 51.44,51.82 53.98,54.36 53.98,62.61 66.67,62.61 66.67,66.9 75.56,66.9 75.56,67.06 H4.2
B6
  Bottom 1.27: JP8.3 182.88,118.49 182.88,113.41 173.35,113.41 169.57,117.83 141.6,117.83 141.6,55.63 140.34,54.36 H2.7
B7
  Bottom 1.27: JP8.4 175.26,115.95 171.47,120.37 129.59,120.37 126.44,120.4 114.94,120.4 114.94,75.95 129.54,75.95 130.18,75.31 130.18,56.9 H2.6
C4
  Bottom 1.27: ARDUINO_NANO1.16 48.89,103.25 48.89,56.9 16.51,56.9 16.51,27.69 101.6,28.06 101.98,28.06 104.14,30.23 104.14,61.34 104.77,61.98 H1.7
C5
  Bottom 1.27: ARDUINO_NANO1.17 46.36,100.71 46.36,59.44 13.97,59.44 13.97,25.15 102.87,25.4 106.68,28.96 106.68,59.44 H1.6
C6
  Bottom 1.27: H1.5 109.22,56.9 109.22,27.05 192.41,27.05 192.41,61.98 175.26,61.98 ARDUINO_NANO3.16
C7
  Bottom 1.27: H1.4 111.76,54.36 111.76,29.97 189.87,29.97 189.87,59.44 172.72,59.44 172.72,68.33 ARDUINO_NANO3.17
D2
  Bottom 1.27: JP1.4 62.86,112.78 64.77,110.87 64.77,103.89 69.85,103.89 73.66,100.08 73.66,72.77 83.19,72.77 84.45,71.5 84.45,59.44 H3.5
D3
  Bottom 1.27: H3.6 87,56.9 87,72.14 83.82,75.31 78.11,75.31 76.83,76.58 76.83,101.35 71.75,106.43 67.31,106.43 66.67,107.06 66.67,112.78 64.14,115.32 JP1.3
D6
  Bottom 1.27: H1.3 114.94,51.82 114.94,32.13 JP3.4
D7
  Bottom 1.27: JP3.3 117.47,35.31 117.47,49.28 H1.2
E1
  Bottom 1.27: JP4.4 31.75,127.38 31.75,118.17 65.09,118.17 69.22,114.05 69.22,108.97 73.03,108.97 79.38,102.62 79.38,79.12 80.64,77.85 85.09,77.85 89.53,73.41 89.53,54.36 H3.7
E2
  Bottom 1.27: JP4.3 33.66,129.92 33.66,121.03 70.48,121.03 72.39,119.13 72.39,114.68 81.92,105.16 81.92,81.03 82.55,80.39 86.36,80.39 89.53,77.22 92.71,77.22 92.71,53.72 90.8,51.82 H3.8
E4  (via drill 1 pad 2.03)
  Top 1.27: v60.33,41.66 v60.33,22.61
  Bottom 1.27: ARDUINO_NANO2.5 142.88,16.13 141.69,14.35 125.09,14.35 125.09,19.43 123.19,21.34 105.59,21.34 104.43,20.18 103.61,20.18 102.23,18.8 90.71,18.8 89.32,20.19 75.06,20.19 73.66,18.8 63.5,18.8 62.23,20.07 v60.33,22.61 | H4.5 78.32,59.02 75.75,59.02 60.33,43.6 v60.33,41.66
E5  (via drill 1 pad 1.52, 1 pad 2.03)
  Top 1.27: v64.77,22.73 v64.77,41.66
  Bottom 1.27: v64.77,22.73 103.29,22.73 104.77,24.09 104.77,24.51 127.63,24.51 127.76,16.38 140.31,16.38 140.34,18.32 ARDUINO_NANO2.4 | H4.6 78.32,56.48 77.12,56.48 64.77,44.13 v64.77,41.66
G  (via drill 1 pad 2.03)
  Top 1.27: v145.92,11.68 v146.05,4.83
  Bottom 1.27: X1.1 3.2,12.42 5.71,9.91 9.52,9.91 | X2.1 191.13,14.96 191.01,3.94 165.99,3.94 | 165.99,3.94 ARDUINO_NANO2.14 | 165.99,3.94 162.05,4.06 155.04,12.45 146.58,12.34 v145.92,11.68 146.56,11.68 144.92,10.05 108.44,10.05 104.14,14.35 JP23.5 JP23.4 JP23.3 JP23.2 JP23.1 | v146.05,4.83 83.19,4.83 81.28,6.73 55.88,6.73 52.7,11.81 49.05,13.44 | 9.52,9.91 13.97,14.35 45.09,14.35 | 49.05,13.44 46.99,14.35 45.09,14.35 | 9.52,9.91 12.7,6.73 12.7,2.29 12.65,1.91 15.08,1.89 17.51,1.89 26.03,1.91 26.67,2.29 26.99,3.87 X5.GND | 44.77,14.03 45.09,14.35 | X6.GND 48.58,12.96 49.05,13.44
GNDPS  (via drill 1 pad 2.03)
  Top 1.27: v31.75,41.66 v38.73,41.66
  Bottom 1.27: 121.28,127.38 103.5,127.38 | 103.5,127.38 100.97,127.38 100.97,126.11 78.16,126.11 | 78.16,126.11 67.94,126.11 | 67.94,126.11 2_7809.GND 67.94,131.83 68.58,133.73 R4.1 | 46.36,139.19 50.16,139.19 2_7805.GND 50.16,128.02 51.44,126.75 R2.1 C3.- 67.94,126.11 | 46.36,139.19 17.78,139.19 17.78,117.86 | 17.78,117.86 JP1.2 29.21,117.86 29.21,123.57 22.86,123.57 22.86,132.46 JP4.2 | 60.96,100.71 ARDUINO_NANO1.14 | 60.96,100.71 60.96,110.11 17.78,110.11 17.78,117.86 | 1_7809.GND 121.28,127.38 | 141.6,127.38 R3.1 130.18,127.38 | 159.38,127.38 165.1,127.38 165.1,133.86 178.31,133.86 JP7.2 182.25,133.73 | 159.38,127.38 141.6,127.38 | 1_7805.GND 141.6,127.38 | ARDUINO_NANO3.14 170.81,68.2 170.69,56.9 187.32,56.9 187.32,37.85 JP3.2 175.26,37.85 175.26,43.56 | 175.26,43.56 182.25,43.56 182.25,51.82 JP2.2 167,51.82 166.37,52.45 166.37,60.07 151.13,60.07 144.91,66.29 144.78,66.29 144.78,112.14 167.64,112.14 171.45,110.87 185.42,110.87 185.42,121.03 JP8.2 176.53,121.03 175.26,122.3 175.26,126.11 182.88,126.11 182.88,133.1 182.25,133.73 | JP6.2 31.34,38.48 31.75,38.89 v31.75,41.66 31.75,44.2 23.5,44.2 23.5,51.82 JP5.2 31.75,51.82 31.75,54.36 50.32,54.36 51.44,55.47 51.44,65.15 64.14,65.15 64.14,100.71 60.96,100.71 | 159.38,127.38 159.38,130.56 | 159.38,130.56 R1.1 | 175.26,43.56 175.26,44.83 160.66,44.83 ARDUINO_NANO2.19 | JP9.1 47.62,41.66 v38.73,41.66 | VIN.2 78.16,126.11 | 130.18,127.38 121.28,127.38 | C4.2 46.48,139.06 46.36,139.19 | C2.- 130.18,128.52 130.18,127.38 | C1.2 159.38,130.56 | JP21.1 JP21.2 JP21.3 JP21.4 JP21.5 103.5,127.38 | 182.25,133.73 191.77,133.73 X3.2
N$2
  Bottom 1.27: LED2.A 52.7,138.81 2_7805.IN 56.52,131.19 C3.+ 60.33,128.65 62.23,130.56 2_7809.OUT
N$3
  Bottom 1.27: 1_7809.OUT 123.83,139.45 130.81,139.45 | 1_7805.IN 139.06,139.45 130.81,139.45 | 130.81,139.45 LED1.A 130.81,131.95 C2.+
N$4
  Bottom 1.27: R1.2 156.21,136.27 LED3.K
N$5
  Bottom 1.27: LED4.K 37.47,130.56 37.47,126.11 R2.2 | R2.2
N$6
  Bottom 1.27: R3.2 134.62,134.37 133.35,135.64 LED1.K
N$7
  Bottom 1.27: LED2.K 62.86,138.81 R4.2
N$8
  Bottom 1.27: ARDUINO_NANO2.2 135.51,22.99 JP12.1
N$9
  Bottom 1.27: ARDUINO_NANO2.11 JP10.2
N$10
  Bottom 1.27: ARDUINO_NANO2.10 JP10.3
N$11
  Bottom 1.27: ARDUINO_NANO2.9 JP10.4
N$12
  Bottom 1.27: ARDUINO_NANO2.8 JP10.5
N$13
  Bottom 1.27: ARDUINO_NANO2.7 JP10.6
N$14
  Bottom 1.27: ARDUINO_NANO2.6 JP10.7
N$15
  Bottom 1.27: ARDUINO_NANO2.30 132.72,42.61 JP11.1
N$16
  Bottom 1.27: ARDUINO_NANO2.29 135.25,42.61 JP11.2
N$17
  Bottom 1.27: ARDUINO_NANO2.28 137.8,42.61 JP11.3
N$18
  Bottom 1.27: ARDUINO_NANO2.27 140.34,42.61 JP11.4
N$19
  Bottom 1.27: ARDUINO_NANO2.26 142.88,42.61 JP11.5
N$20
  Bottom 1.27: ARDUINO_NANO2.25 145.41,42.61 JP11.6
N$21
  Bottom 1.27: ARDUINO_NANO2.24 147.96,42.61 JP11.7
N$22
  Bottom 1.27: ARDUINO_NANO2.23 150.5,42.61 JP11.8
N$23
  Bottom 1.27: ARDUINO_NANO2.22 153.03,42.61 JP11.9
N$24
  Bottom 1.27: ARDUINO_NANO2.21 155.57,42.61 JP11.10
N$25
  Bottom 1.27: ARDUINO_NANO2.20 158.12,42.61 JP11.11
N$26
  Bottom 1.27: ARDUINO_NANO2.1 132.97,22.99 JP12.2
N$29
  Bottom 1.27: ARDUINO_NANO2.17 165.73,41.66 JP13.1
N$30
  Bottom 1.27: ARDUINO_NANO2.16 168.28,41.66 JP13.2
N$31
  Bottom 1.27: JP14.1 ARDUINO_NANO1.11
N$32
  Bottom 1.27: JP14.2 ARDUINO_NANO1.10
N$33
  Bottom 1.27: JP14.3 ARDUINO_NANO1.9
N$34
  Bottom 1.27: JP14.4 ARDUINO_NANO1.8
N$35
  Bottom 1.27: JP14.5 ARDUINO_NANO1.7
N$36
  Bottom 1.27: JP14.6 ARDUINO_NANO1.6
N$37
  Bottom 1.27: JP14.7 ARDUINO_NANO1.5
N$38
  Bottom 1.27: JP14.8 ARDUINO_NANO1.4
N$39
  Bottom 1.27: ARDUINO_NANO1.2 57.78,70.23 58.42,70.87 JP15.1
N$40
  Bottom 1.27: ARDUINO_NANO1.1 59.06,67.69 JP15.2
N$41
  Bottom 1.27: JP16.1 31.12,77.22 31.75,77.85 ARDUINO_NANO1.26
N$42
  Bottom 1.27: JP16.2 31.75,79.76 32.38,80.39 ARDUINO_NANO1.25
N$43
  Bottom 1.27: JP16.3 30.48,82.3 31.12,82.93 ARDUINO_NANO1.24
N$44
  Bottom 1.27: JP17.1 159.38,75.95 ARDUINO_NANO3.11
N$45
  Bottom 1.27: JP17.2 159.38,78.49 ARDUINO_NANO3.10
N$46
  Bottom 1.27: JP17.3 159.38,81.03 ARDUINO_NANO3.9
N$47
  Bottom 1.27: JP17.4 159.38,83.57 ARDUINO_NANO3.8
N$48
  Bottom 1.27: JP17.5 159.38,86.11 ARDUINO_NANO3.7
N$49
  Bottom 1.27: JP17.6 159.38,88.65 ARDUINO_NANO3.6
N$50
  Bottom 1.27: JP17.7 159.38,91.19 ARDUINO_NANO3.5
N$51
  Bottom 1.27: JP17.8 159.38,93.73 ARDUINO_NANO3.4
N$52
  Bottom 1.27: ARDUINO_NANO3.2 160.27,98.42 JP18.1
N$53
  Bottom 1.27: ARDUINO_NANO3.1 160.27,100.97 JP18.2
N$54
  Bottom 1.27: JP19.1 175.26,91.19 ARDUINO_NANO3.26
N$55
  Bottom 1.27: JP19.2 175.26,88.65 ARDUINO_NANO3.25
N$56
  Bottom 1.27: JP19.3 175.26,86.11 ARDUINO_NANO3.24
N$59
  Bottom 1.27: ARDUINO_NANO2.12 JP10.1 160.66,14.35 144.53,14.35 144.09,13.75 143.27,12.62 143.09,12.45 122.55,12.45 120.02,14.99 JP22.5 JP22.4 JP22.3 JP22.2 JP22.1

### Text on the board
tPlace: - | + | - | + | - | + | ENCODER5 | ENCODER1 | VCC | VCC | GND | GND | INT1 | INT1 | INT2 | INT2 | 7805 | 7809 | 7805 | 7809 | MAIN_POWER | ENCODER6 | POWER_MOTOR | POWER_MOTOR | VCC | ENCODER2 | VCC | GND | GND | VCC | GND | INT1 | INT1 | INT2 | INT2 | CYTRON1 | DIR1 | TIVA_C | CYTRON3 | PWM1 | D13 | DIR1 | DIR2 | PWM1 | PWM2 | DIR2 | GND | A7 | A0 | PWM2 | A6 | A1 | D8 | GND | A5 | A2 | D7 | A4 | A3 | D6 | A3 | A4 | 3.3V | A2 | A5 | D13 | CYTRON4 | A1 | A6 | A7 | GND | GND | A0 | CYTRON2 | PWM2 | PWM2 | 3.3V | DIR2 | DIR2 | 3.3V | VBUS | F2 | GND | PWM1 | D13 | PWM1 | B2 | B5 | GND | F3 | DIR1 | DIR1 | B0 | D0 | D0 | B3 | E0 | F0 | B1 | D1 | C4 | E4 | D2 | C5 | RST | B7 | ENCODER3 | E5 | D3 | C6 | ENCODER7 | VCC | B4 | E1 | C7 | B6 | VCC | GND | A4 | GND | A5 | E2 | D6 | INT1 | RASPERRY_PI | A3 | INT1 | A6 | E3 | D7 | INT2 | A2 | INT2 | A7 | F1 | F4 | GND | RX | TX | D12 | D11 | D10 | D9 | D8 | D7 | D6 | D5 | D4 | D3 | D2 | RX | TX | ENCODER4 | ENCODER8 | VCC | VCC | GND | GND | INT1 | INT1 | INT2 | INT2 | POWER_MOTOR | POWER_MOTOR | A2 | A3 | A4 | A5 | A6 | A7 | 5V | 5V | VCC | GND | D13 | 3.3V | USB_PORT | USB_PORT | - | + | - | + | VCC | GND | VCC | GND
bPlace: 3.3V | D13